# EAGLE design output_new (EAGLE 9.6.2)
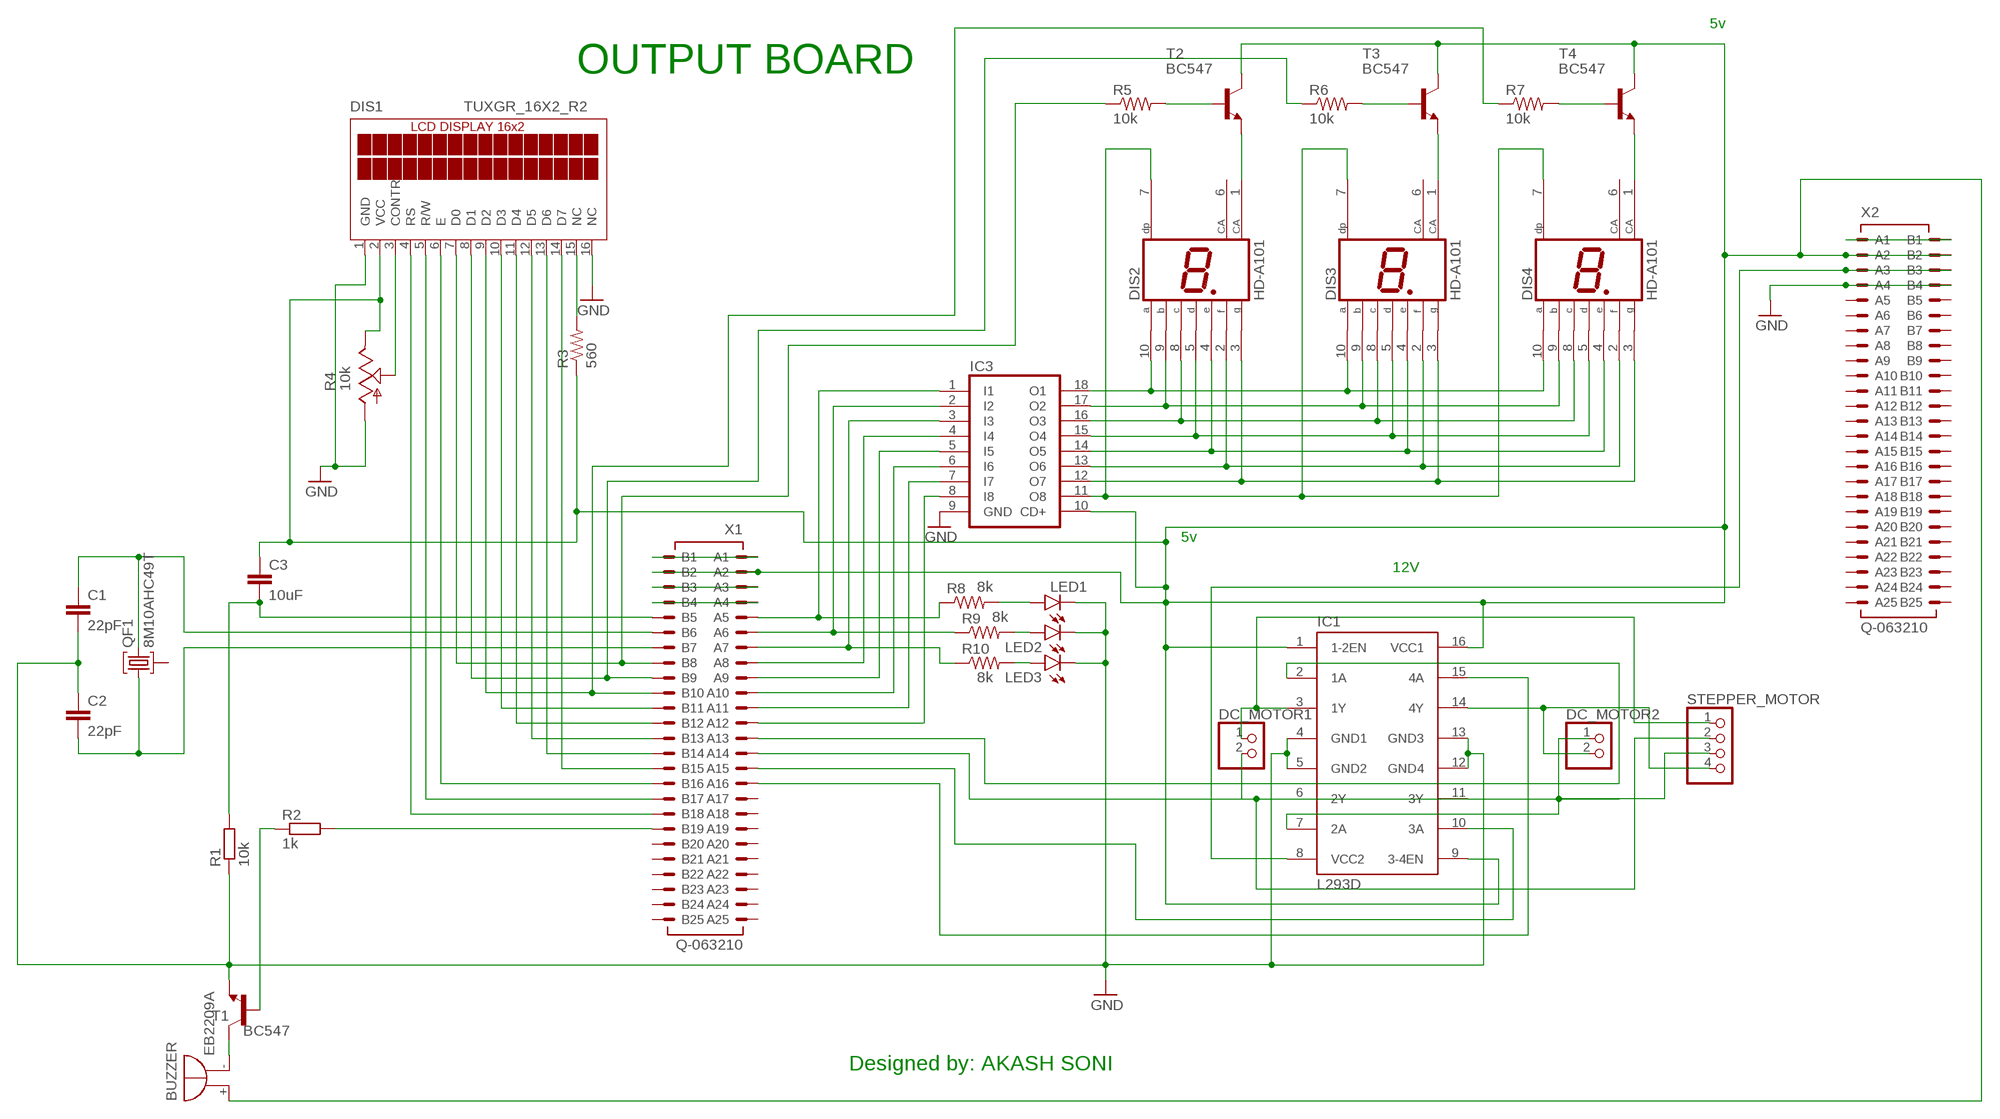
[diagram p0: schematic, sheet 1]

## Parts
BUZZER  EB2209A  [EB2209A]
C1  22pF  C2,5-3  [C2.5-3]
C2  22pF  C2,5-3  [C2.5-3]
C3  10uF  C2,5-3  [C2.5-3]
DC_MOTOR1  PINHD-1X2  [1X02]
DC_MOTOR2  PINHD-1X2  [1X02]
DIS1  TUXGR_16X2_R2  [TUXGR_16X2_R2]
DIS2  HD-A101  [HDSP-A]
DIS3  HD-A101  [HDSP-A]
DIS4  HD-A101  [HDSP-A]
IC1  L293D  [DIL16]
IC3  ULN2803A  [DIL18]
LED1  LED5MM  [LED5MM]
LED2  LED5MM  [LED5MM]
LED3  LED5MM  [LED5MM]
QF1  8M10AHC49T  [HC49U]
R1  10k  R-EU_0204/2V  [0204V]
R2  1k  R-EU_0204/2V  [0204V]
R3  560  R-US_0204/2V  [0204V]
R4  10k  TRIM_US-CA6V  [CA6V]
R5  10k  R-US_0204/2V  [0204V]
R6  10k  R-US_0204/2V  [0204V]
R7  10k  R-US_0204/2V  [0204V]
R8  8k  R-US_0204/2V  [0204V]
R9  8k  R-US_0204/2V  [0204V]
R10  8k  R-US_0204/2V  [0204V]
STEPPER_MOTOR  PINHD-1X4  [1X04]
T1  BC547  [TO92]
T2  BC547  [TO92]
T3  BC547  [TO92]
T4  BC547  [TO92]
X1  Q-063210  [063210]
X2  Q-063210  [063210]

## Nets
GND: C1.2 C2.1 DIS1.1(GND) DIS1.16(NC) IC1.4(GND1) IC1.5(GND2) IC1.12(GND4) IC1.13(GND3) IC3.9(GND) LED1.K(C) LED2.K(C) LED3.K(C) R1.1 R4.A T1.1(E) X2.A4 X2.B4
N$1: DC_MOTOR1.1 IC1.3(1Y) STEPPER_MOTOR.1
N$2: DC_MOTOR1.2 IC1.6(2Y) STEPPER_MOTOR.2
N$3: DC_MOTOR2.2 IC1.14(4Y) STEPPER_MOTOR.4
N$4: DC_MOTOR2.1 IC1.7(2A) IC1.11(3Y) STEPPER_MOTOR.3
N$5: C3.2 R1.2 X1.B5
N$6: C1.1 QF1.3 X1.B6
N$7: IC1.2(1A) X1.A13
N$8: X1.A14
N$9: IC1.10(3A) X1.A15
N$10: IC1.15(4A) X1.A16
N$11: R2.2 X1.B19
N$12: C2.2 QF1.1 X1.B7
N$13: R2.1 T1.2(B)
N$14: BUZZER.- T1.3(C)
N$15: DIS1.14(D7) X1.B15
N$16: DIS1.13(D6) X1.B14
N$17: X2.A1 X2.B1
N$18: DIS1.11(D4) X1.B12
N$19: DIS1.10(D3) X1.B11
N$20: DIS1.9(D2) R7.1 X1.B10
N$21: DIS1.8(D1) R6.1 X1.B9
N$22: DIS1.12(D5) X1.B13
N$23: DIS1.15(NC) R3.2
N$24: DIS1.6(E) X1.B16
N$25: DIS1.5(R/W) X1.B17
N$26: DIS1.4(RS) X1.B18
N$27: DIS1.3(CONTR) R4.S
N$28: IC3.8(I8) X1.A12
N$29: IC3.7(I7) X1.A11
N$30: IC3.6(I6) X1.A10
N$31: IC3.5(I5) X1.A9
N$32: IC3.4(I4) X1.A8
N$34: IC3.2(I2) R9.1 X1.A6
N$35: IC3.1(I1) R8.1 X1.A5
N$36: DIS2.10(A) DIS3.10(A) DIS4.10(A) IC3.18(O1)
N$37: DIS2.9(B) DIS3.9(B) DIS4.9(B) IC3.17(O2)
N$38: DIS2.8(C) DIS3.8(C) DIS4.8(C) IC3.16(O3)
N$39: DIS2.5(D) DIS3.5(D) DIS4.5(D) IC3.15(O4)
N$40: DIS2.4(E) DIS3.4(E) DIS4.4(E) IC3.14(O5)
N$41: DIS2.2(F) DIS3.2(F) DIS4.2(F) IC3.13(O6)
N$42: DIS2.3(G) DIS3.3(G) DIS4.3(G) IC3.12(O7)
N$43: DIS2.1(CA) T2.1(E)
N$44: DIS2.7(DP) DIS3.7(DP) DIS4.7(DP) IC3.11(O8)
N$45: DIS3.1(CA) T3.1(E)
N$46: DIS4.1(CA) T4.1(E)
N$47: R5.2 T2.2(B)
N$48: R6.2 T3.2(B)
N$49: R7.2 T4.2(B)
N$50: LED1.A R8.2
N$51: LED2.A R9.2
N$52: LED3.A R10.2
N$53: IC1.8(VCC2) X2.A3 X2.B3
N$54: DIS1.7(D0) R5.1 X1.B8
N$56: X1.A1 X1.B1
N$112: BUZZER.+ C3.1 DIS1.2(VCC) IC1.1(1-2EN) IC1.9(3-4EN) IC1.16(VCC1) IC3.10(CD+) R3.1 R4.E T2.3(C) T3.3(C) T4.3(C) X1.A2 X1.B2 X2.A2 X2.B2
N$113: X1.A3 X1.B3
N$114: X1.A4 X1.B4
N$115: IC3.3(I3) R10.1 X1.A7
Unconnected: DIS2.6(CA) DIS3.6(CA) DIS4.6(CA) QF1.2 X1.A17 X1.A18 X1.A19 X1.A20 X1.A21 X1.A22 X1.A23 X1.A24 X1.A25 X1.B20 X1.B21 X1.B22 X1.B23 X1.B24 X1.B25 X2.A5 X2.A6 X2.A7 X2.A8 X2.A9 X2.A10 X2.A11 X2.A12 X2.A13 X2.A14 X2.A15 X2.A16 X2.A17 X2.A18 X2.A19 X2.A20 X2.A21 X2.A22 X2.A23 X2.A24 X2.A25 X2.B5 X2.B6 X2.B7 X2.B8 X2.B9 X2.B10 X2.B11 X2.B12 X2.B13 X2.B14 X2.B15 X2.B16 X2.B17 X2.B18 X2.B19 X2.B20 X2.B21 X2.B22 X2.B23 X2.B24 X2.B25

## Notes on the sheet
- 5v
- OUTPUT BOARD
- 5v
- 12V
- Designed by: AKASH SONI

## Library data of the parts
BUZZER = buzzer:EB2209A: BUZZER Source: Buerklin; OC_FARNELL: unknown; OC_NEWARK: unknown
C1-C3 = capacitor-wima:C: CAPACITOR naming: grid - package width
DC_MOTOR1 DC_MOTOR2 = pinhead:PINHD-1X2: PIN HEADER
DIS1 = display-lcd:TUXGR_16X2_R2: Tuxgraphics LCD display 16x2 characters reflective, without background light Source: tuxgr_12x2_r2.pdf; OC_FARNELL: unknown; OC_NEWARK: unknown
DIS2-DIS4 = display-hp:HD-A101: LED DISPLAY 1-character 7 segment, decimal point right; OC_FARNELL: unknown; OC_NEWARK: unknown
IC1 = st-microelectronics:L293D: PUSH-PULL 4 CHANNEL DRIVER; MPN: L293D; OC_FARNELL: 9589619; OC_NEWARK: 56P8249
IC3 = uln-udn:ULN2803A: DRIVER ARRAY
LED1-LED3 = led:LED: LED OSRAM: - CHIPLED LG R971, LG N971, LY N971, LG Q971, LY Q971, LO R971, LY R971 LH N974, LH R974 LS Q976, LO Q976, LY Q976 LO Q996 - Hyper CHIPLED LW Q18S LB Q993, LB Q99A, LB R99A - SideLED LS A670, LO A670, LY A670, LG A670, LP A670 LB A673, LV A673, LT A673, LW A673 LH A674 LY A675 LS A676, LA A676, LO A676, LY A676, LW A676 LS A679, LY A679, LG A679 - Hyper Micro SIDELED® LS Y876, LA Y876, LO Y876, LY Y876 LT Y87S - SmartLED LW L88C, LW L88S LB L89C, LB L89S, LG L890 LS L89K, LO L89K, LY L89K LS L896, LA L896, LO L896, LY L896 - TOPLED LS T670, LO T670, LY T670, LG T670, LP T670 LSG T670, LSP T670, LSY T670, LOP T670, LYG T670 LG T671, LOG T671, LSG T671 LB T673, LV T673, LT T673, LW T673 LH T674 LS T676, LA T676, LO T676, LY T676, LB T676, LH T676, LSB T676, LW T676 LB T67C, LV T67C, LT T67C, LS T67K, LO T67K, LY T67K, LW E67C LS E67B, LA E67B, LO E67B, LY E67B, LB E67C, LV E67C, LT E67C LW T67C LS T679, LY T679, LG T679 LS T770, LO T770, LY T770, LG T770, LP T770 LB T773, LV T773, LT T773, LW T773 LH T774 LS E675, LA E675, LY E675, LS T675 LS T776, LA T776, LO T776, LY T776, LB T776 LHGB T686 LT T68C, LB T68C - Hyper Mini TOPLED® LB M676 - Mini TOPLED Santana® LG M470 LS M47K, LO M47K, LY M47K Source: http://www.osram.convergy.de LUXEON: - LUMILED® LXK2-PW12-R00, LXK2-PW12-S00, LXK2-PW14-U00, LXK2-PW14-V00 LXK2-PM12-R00, LXK2-PM12-S00, LXK2-PM14-U00 LXK2-PE12-Q00, LXK2-PE12-R00, LXK2-PE12-S00, LXK2-PE14-T00, LXK2-PE14-U00 LXK2-PB12-K00, LXK2-PB12-L00, LXK2-PB12-M00, LXK2-PB14-N00, LXK2-PB14-P00, LXK2-PB14-Q00 LXK2-PR12-L00, LXK2-PR12-M00, LXK2-PR14-Q00, LXK2-PR14-R00 LXK2-PD12-Q00, LXK2-PD12-R00, LXK2-PD12-S00 LXK2-PH12-R00, LXK2-PH12-S00 LXK2-PL12-P00, LXK2-PL12-Q00, LXK2-PL12-R00 Source: www.luxeon.com KINGBRIGHT: KA-3528ASYC Source: www.kingbright.com
QF1 = crystal:8M10AHC49T: Monolithic Crystal Filters Source: www.vanlong.com; OC_FARNELL: unknown; OC_NEWARK: unknown
R1 R2 = rcl:R-EU_: RESISTOR, European symbol; SPICEPREFIX: R
R3 R5-R10 = rcl:R-US_: RESISTOR, American symbol; SPICEPREFIX: R
R4 = pot:TRIM_US-: POTENTIOMETER
STEPPER_MOTOR = pinhead:PINHD-1X4: PIN HEADER
T1-T4 = transistor:BC547: NPN TRANSISTOR
X1 X2 = con-erni:Q-063210: Male Connector SMC-Q 50 contacts Standard Assembly Height Source: http://www.erni.com/DB/PDF-Drawing/SMC/063210.pdf; OC_FARNELL: unknown; OC_NEWARK: unknown

## Board
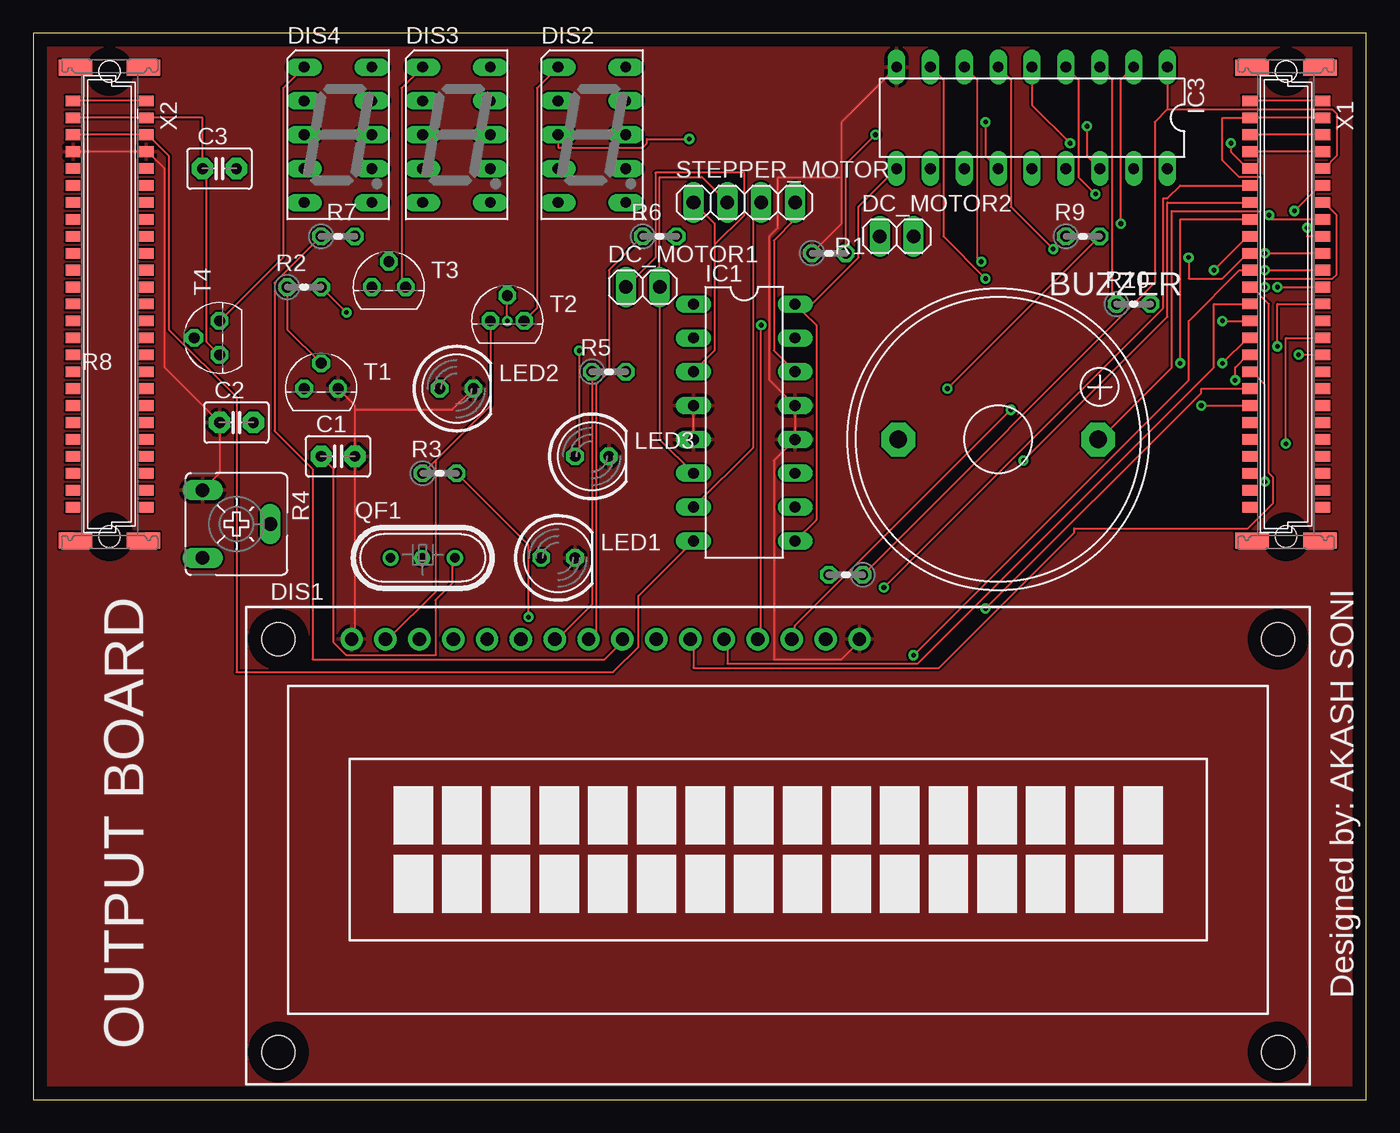
[diagram p1: board, top side]
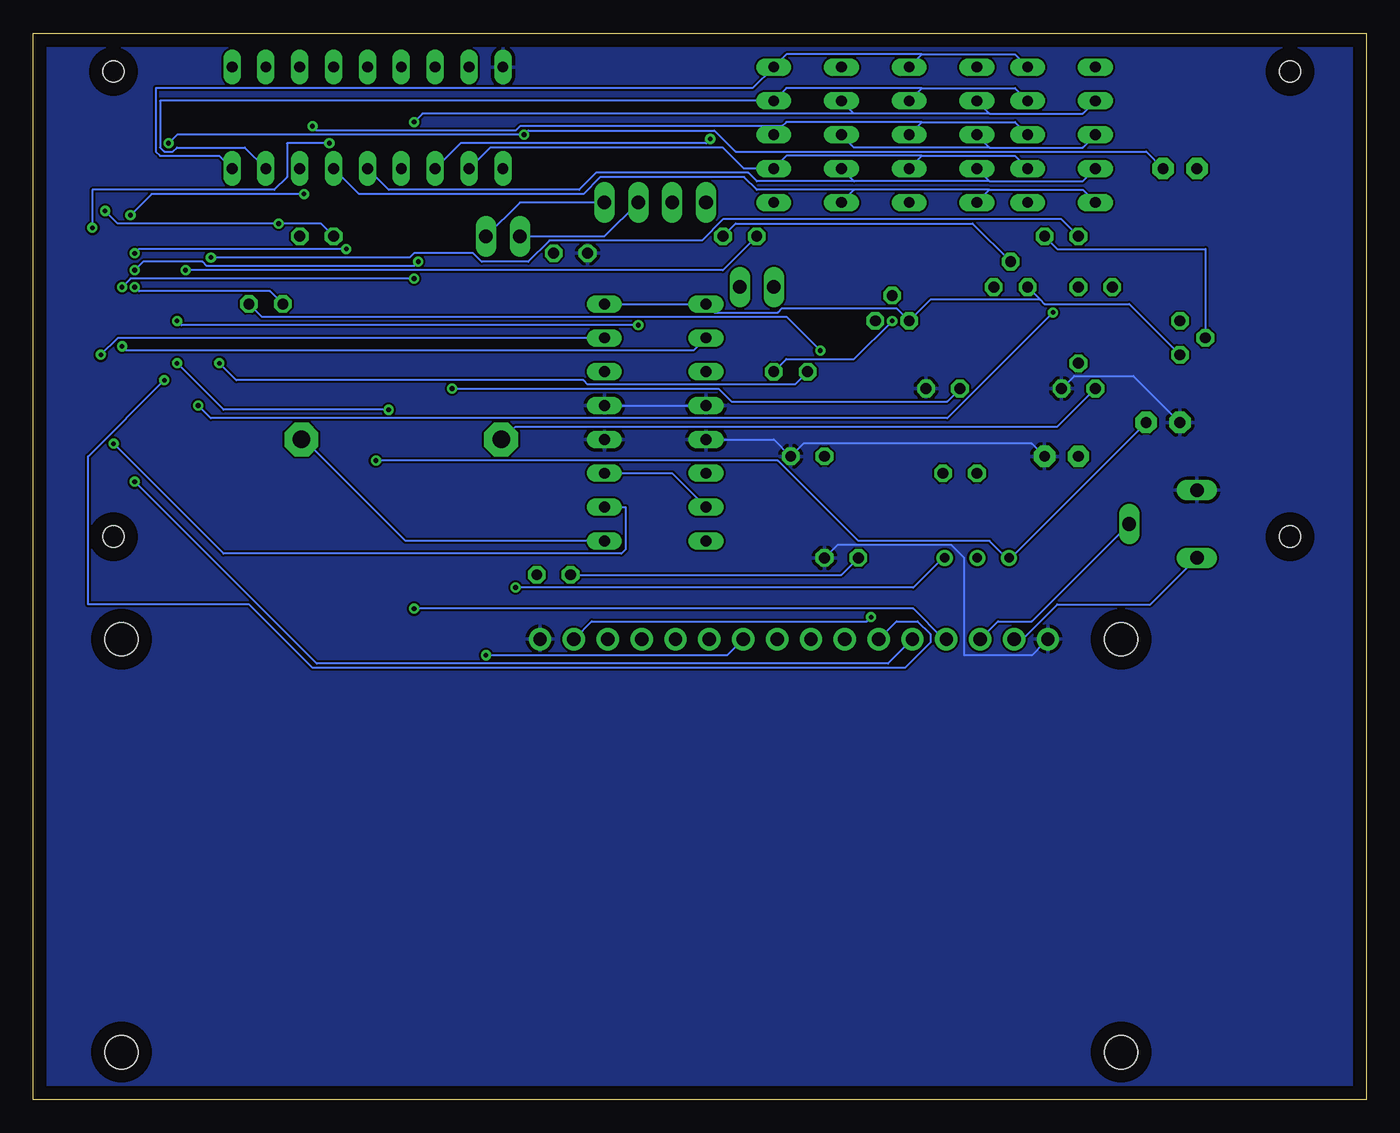
[diagram p2: board, bottom side, seen from below]

Size 100 x 80 mm. Coordinates in mm from the lower left corner, seen from the top.
Outline: 0,0 100,0 100,80 0,80 0,0
Copper layers (1*16): Top 0.035mm / dielectric 1.5mm / Bottom 0.035mm
Design rules "default": minimum track width 6mil, minimum drill 0.35mm, track to track 6mil, track to pad 6mil, pad to pad 6mil, via to via 6mil, smd to smd 6mil, copper to edge 40mil, drill to drill 6mil, minimum pad ring 10mil, minimum via ring 8mil, stop-mask expansion 4mil, vias tented up to drill 0mil, thermal gap 10mil

### Footprints (pad centres in the part's own frame; a part is rotated, then mirrored left to right if it is on the bottom)
EB2209A = drill 1.321 pad 2.54 octagon: + 7.493,0; - -7.493,0
C2.5-3 = drill 0.813 pad 1.6 octagon: 1 -1.27,0; 2 1.27,0
1X02 = drill 1.016 long: 1 -1.27,0; 2 1.27,0
TUXGR_16X2_R2 = drill 1 pad 1.676: 1 -32,15.5; 2 -29.46,15.5; 3 -26.92,15.5; 4 -24.38,15.5; 5 -21.84,15.5; 6 -19.3,15.5; 7 -16.76,15.5; 8 -14.22,15.5; 9 -11.68,15.5; 10 -9.14,15.5; 11 -6.6,15.5; 12 -4.06,15.5; 13 -1.52,15.5; 14 1.02,15.5; 15 3.56,15.5; 16 6.1,15.5 | hole 2.5: -37.5,-15.5; 37.5,-15.5; -37.5,15.5; 37.5,15.5
HDSP-A = drill 0.813 long: 1 -2.54,5.08; 2 -2.54,2.54; 3 -2.54,0; 4 -2.54,-2.54; 5 -2.54,-5.08; 6 2.54,-5.08; 7 2.54,-2.54; 8 2.54,0; 9 2.54,2.54; 10 2.54,5.08
DIL16 = drill 0.813 long: 1 -8.89,-3.81; 2 -6.35,-3.81; 3 -3.81,-3.81; 4 -1.27,-3.81; 5 1.27,-3.81; 6 3.81,-3.81; 7 6.35,-3.81; 8 8.89,-3.81; 9 8.89,3.81; 10 6.35,3.81; 11 3.81,3.81; 12 1.27,3.81; 13 -1.27,3.81; 14 -3.81,3.81; 15 -6.35,3.81; 16 -8.89,3.81
DIL18 = drill 0.813 long: 1 -10.16,-3.81; 2 -7.62,-3.81; 3 -5.08,-3.81; 4 -2.54,-3.81; 5 0,-3.81; 6 2.54,-3.81; 7 5.08,-3.81; 8 7.62,-3.81; 9 10.16,-3.81; 10 10.16,3.81; 11 7.62,3.81; 12 5.08,3.81; 13 2.54,3.81; 14 0,3.81; 15 -2.54,3.81; 16 -5.08,3.81; 17 -7.62,3.81; 18 -10.16,3.81
LED5MM = drill 0.813 octagon: A -1.27,0; K 1.27,0
HC49U = drill 0.7 pad 1.2: 1 -2.413,0; 2 -0.027,0; 3 2.413,0
0204V = drill 0.813 octagon: 1 -1.27,0; 2 1.27,0
CA6V = drill 1.016 long: A -2.54,-2.54; E 2.54,-2.54; S 0,2.54
1X04 = drill 1.016 long: 1 -3.81,0; 2 -1.27,0; 3 1.27,0; 4 3.81,0
TO92 = drill 0.813 octagon: 1 1.27,0; 2 0,1.905; 3 -1.27,0
063210 = smd 0.8 x 1.1: A1 -15.24,2.765; A2 -13.97,2.765; A3 -12.7,2.765; A4 -11.43,2.765; A5 -10.16,2.765; A6 -8.89,2.765; A7 -7.62,2.765; A8 -6.35,2.765; A9 -5.08,2.765; A10 -3.81,2.765; A11 -2.54,2.765; A12 -1.27,2.765; A13 0,2.765; A14 1.27,2.765; A15 2.54,2.765; A16 3.81,2.765; A17 5.08,2.765; A18 6.35,2.765; A19 7.62,2.765; A20 8.89,2.765; A21 10.16,2.765; A22 11.43,2.765; A23 12.7,2.765; A24 13.97,2.765; A25 15.24,2.765; B1 -15.24,-2.74; B2 -13.97,-2.74; B3 -12.7,-2.74; B4 -11.43,-2.74; B5 -10.16,-2.74; B6 -8.89,-2.74; B7 -7.62,-2.74; B8 -6.35,-2.74; B9 -5.08,-2.74; B10 -3.81,-2.74; B11 -2.54,-2.74; B12 -1.27,-2.74; B13 0,-2.74; B14 1.27,-2.74; B15 2.54,-2.74; B16 3.81,-2.74; B17 5.08,-2.74; B18 6.35,-2.74; B19 7.62,-2.74; B20 8.89,-2.74; B21 10.16,-2.74; B22 11.43,-2.74; B23 12.7,-2.74; B24 13.97,-2.74; B25 15.24,-2.74 | smd 1.2 x 2.5: M1 -17.745,2.55; M2 -17.745,-2.55; M3 17.745,-2.55; M4 17.745,2.55 | hole 1.6: -17.45,0; 17.45,0

### Placement (x,y rotation side)
BUZZER  72.39,49.53 0 top
C1  22.86,48.26 0 top
C2  15.24,50.8 0 top
C3  13.97,69.85 0 top
DC_MOTOR1  45.72,60.96 0 top
DC_MOTOR2  64.77,64.77 0 top
DIS1  55.88,19.05 0 top
DIS2  41.91,72.39 0 top
DIS3  31.75,72.39 0 top
DIS4  22.86,72.39 0 top
IC1  53.34,50.8 270 top
IC3  74.93,73.66 180 top
LED1  39.37,40.64 0 top
LED2  31.75,53.34 0 top
LED3  41.91,48.26 0 top
QF1  29.21,40.64 0 top
R1  59.69,63.5 0 top
R2  20.32,60.96 0 top
R3  30.48,46.99 0 top
R4  15.24,43.18 270 top
R5  43.18,54.61 0 top
R6  46.99,64.77 0 top
R7  22.86,64.77 0 top
R8  60.96,39.37 180 top
R9  78.74,64.77 0 top
R10  82.55,59.69 0 top
STEPPER_MOTOR  53.34,67.31 0 top
T1  21.59,53.34 0 top
T2  35.56,58.42 0 top
T3  26.67,60.96 0 top
T4  13.97,57.15 90 top
X1  93.98,59.69 270 top
X2  5.71,59.69 270 top

### Tracks (layer width: path | path; a pad name or v marks a point on that pad's centre or on a via)
GND
  Top 0.152: R1.1 60.64,65.72 60.64,69.22 | 60.64,69.22 60.64,73.34 IC3.9 | IC1.5 IC1.4 | DIS1.16 61.91,34.29 60.64,33.02 55.56,33.02 55.56,47.94 IC1.12 IC1.13 55.24,53.98 55.24,64.77 55.88,65.41 55.88,69.22 60.64,69.22 | X2.B4 X2.A4 8.57,71.12 9.84,69.85 9.84,54.93 C2.1 13.97,46.99 R4.A | T1.1 24.13,52.07 24.13,51.75 | 24.13,51.75 C1.2 24.13,34.61 DIS1.1 | LED2.K 31.43,51.75 24.13,51.75
  Bottom 0.152: IC1.5 44.45,49.53 LED3.K 42.23,49.21 25.08,49.21 C1.2 | IC1.13 IC1.4 | LED1.K 39.69,41.59 31.11,41.59 30.16,40.64 30.16,33.34 25.08,33.34 24.13,34.29 DIS1.1 | C2.1 17.46,54.29 21.91,54.29 T1.1
  pour Top: -0.64,80.64 -0.64,-0.64 100.97,-0.64 100.97,80.64
  pour Bottom: -1.27,81.28 -1.27,-1.27 101.6,-1.27 101.6,81.28
N$1
  Top 0.152: IC1.3 51.12,56.2 51.12,64.14 | 51.12,64.14 51.12,65.72 STEPPER_MOTOR.1 | DC_MOTOR1.1 46.67,63.18 46.67,69.53 53.34,69.53 53.34,66.36 51.12,64.14
N$2
  Top 0.152: IC1.6 46.99,49.53 DC_MOTOR1.2 46.99,69.22 50.16,69.22 STEPPER_MOTOR.2
N$3
  Top 0.152: IC1.14 55.56,56.2 55.56,64.45 57.15,66.04 STEPPER_MOTOR.4
  Bottom 0.152: DC_MOTOR2.2 63.5,67.31 STEPPER_MOTOR.4
N$4
  Top 0.152: IC1.7 53.98,48.9 53.98,66.67 STEPPER_MOTOR.3
  Bottom 0.152: IC1.7 52.07,46.99 IC1.11 | STEPPER_MOTOR.3 57.15,64.77 DC_MOTOR2.1
N$5  (via drill 0.35)
  Top 0.152: v89.85,71.75 89.85,71.12 91.12,69.85 X1.B5 | v63.18,72.39 60.96,70.17 R1.2
  Bottom 0.152: v89.85,71.75 89.22,72.39 v63.18,72.39 62.87,72.71 48.9,72.71 47.31,71.12 16.51,71.12 C3.2
N$6  (via drill 0.35)
  Top 0.152: X1.B6 86.04,68.58 85.09,67.63 84.77,67.63 84.77,59.37 v63.82,38.42 | C1.1 22.54,47.31 22.54,34.29 23.5,33.34 30.16,33.34 30.16,37.47 31.43,38.73 31.43,40.64 QF1.3
  Bottom 0.152: v63.82,38.42 33.97,38.42 31.75,40.64 QF1.3
N$7  (via drill 0.35)
  Top 0.152: X1.A13 93.34,59.69 v93.34,56.52
  Bottom 0.152: v93.34,56.52 93.03,56.2 50.48,56.2 IC1.2
N$9  (via drill 0.35)
  Top 0.152: X1.A15 93.98,57.15 v93.98,49.21
  Bottom 0.152: v93.98,49.21 85.72,40.96 55.88,40.96 55.56,41.27 55.56,44.45 IC1.10
N$10  (via drill 0.35)
  Top 0.152: v94.93,55.88 X1.A16
  Bottom 0.152: v94.93,55.88 93.66,57.15 IC1.15
N$11  (via drill 0.35)
  Top 0.152: v87.63,52.07 X1.B19 | R2.2 v23.5,59.05
  Bottom 0.152: v87.63,52.07 86.68,51.12 31.43,51.12 v23.5,59.05
N$12  (via drill 0.35)
  Top 0.152: X1.B7 85.09,67.31 85.09,58.74 v74.3,47.94
  Bottom 0.152: v74.3,47.94 44.13,47.94 38.1,41.91 28.26,41.91 26.99,40.64 QF1.1 26.67,40.64 C2.2
N$13
  Top 0.152: T1.2 19.05,57.78 R2.1
N$14
  Bottom 0.152: T1.3 23.18,50.48 63.82,50.48 64.77,49.53 BUZZER.-
N$15  (via drill 0.35)
  Top 0.152: v89.22,55.24 91.12,57.15 X1.B15 | v73.34,51.75 57.15,35.56 57.15,34.61 DIS1.14
  Bottom 0.152: v89.22,55.24 85.72,51.75 v73.34,51.75
N$16  (via drill 0.35)
  Top 0.152: v89.22,58.42 X1.B14 | v54.61,58.1 54.61,34.61 DIS1.13
  Bottom 0.152: v89.22,58.42 88.9,58.1 v54.61,58.1
N$17
  Top 0.152: X2.A1 X2.B1
N$18
  Top 0.152: X1.B12 91.44,60.96 92.71,59.69 92.71,46.99 93.03,46.67 93.03,44.77 91.12,42.86 78.11,42.86 78.11,42.55 67.94,32.38 49.53,32.38 49.53,34.29 DIS1.11
N$19  (via drill 0.35)
  Top 0.152: X1.B11 90.49,62.23 86.68,58.42 86.68,53.98 v66.04,33.34
  Bottom 0.152: v66.04,33.34 47.94,33.34 46.99,34.29 DIS1.10
N$20  (via drill 0.35)
  Top 0.152: v86.68,63.18 86.68,61.59 89.22,61.59 91.12,63.5 X1.B10 | R7.1 18.1,61.28 18.1,50.16 20.95,47.31 20.95,33.02 42.86,33.02 44.13,34.29 DIS1.9
  Bottom 0.152: v86.68,63.18 71.75,63.18 71.44,63.5 66.99,63.5 66.36,62.87 62.87,62.87 61.28,64.45 49.85,64.45 48.26,66.04 22.86,66.04 R7.1
N$21  (via drill 0.35)
  Top 0.152: v88.58,62.23 91.12,64.77 X1.B9 | R6.1 43.18,62.23 43.18,54.61 42.23,53.66 42.23,34.92 41.91,34.61 DIS1.8
  Bottom 0.152: v88.58,62.23 48.26,62.23 R6.1
N$22
  Top 0.152: X1.B13 88.58,59.69 88.58,54.93 66.36,32.7 52.07,32.7 52.07,34.29 DIS1.12
N$23  (via drill 0.35)
  Top 0.152: R3.2 37.15,41.59 v37.15,36.2
  Bottom 0.152: v37.15,36.2 37.47,35.88 58.1,35.88 59.37,34.61 DIS1.15
N$24  (via drill 0.35)
  Top 0.152: v90.17,53.98 90.17,54.93 91.12,55.88 X1.B16
  Bottom 0.152: v90.17,53.98 95.89,48.26 95.89,37.15 83.82,37.15 79.06,32.38 34.61,32.38 32.7,34.29 32.7,34.92 33.66,35.88 35.24,35.88 36.51,34.61 DIS1.6
N$25  (via drill 0.35)
  Top 0.152: v92.39,46.35 92.39,53.66 91.44,54.61 X1.B17
  Bottom 0.152: v92.39,46.35 78.74,32.7 35.88,32.7 34.29,34.29 DIS1.5
N$26  (via drill 0.35)
  Top 0.152: X1.B18 87.63,53.34 87.63,53.02 v71.44,36.83
  Bottom 0.152: v71.44,36.83 33.97,36.83 31.75,34.61 DIS1.4
N$27
  Bottom 0.152: R4.S 25.08,35.88 27.62,35.88 28.89,34.61 DIS1.3
N$28  (via drill 0.35)
  Top 0.152: v93.34,60.96 X1.A12 | v71.44,61.59 68.26,64.77 68.26,76.52 IC3.8
  Bottom 0.152: v93.34,60.96 92.71,61.59 v71.44,61.59
N$29  (via drill 0.35)
  Top 0.152: v92.39,62.23 X1.A11 | v71.12,62.87 70.8,63.18 70.8,76.52 IC3.7
  Bottom 0.152: v92.39,62.23 91.76,62.87 87.31,62.87 87,62.55 71.44,62.55 v71.12,62.87
N$30  (via drill 0.35)
  Top 0.152: v92.39,63.5 X1.A10 | v76.52,63.82 73.34,66.99 73.34,76.52 IC3.6
  Bottom 0.152: v92.39,63.5 92.08,63.82 v76.52,63.82
N$31  (via drill 0.35)
  Top 0.152: X1.A9 95.57,64.77 v95.57,65.41 | v77.79,71.75 74.93,74.61 IC3.5
  Bottom 0.152: v95.57,65.41 95.57,68.26 81.92,68.26 80.96,69.22 80.96,71.75 v77.79,71.75
N$32  (via drill 0.35)
  Top 0.152: X1.A8 92.71,66.04 v92.71,66.36 | v79.69,67.94 78.42,69.22 78.42,76.52 IC3.4
  Bottom 0.152: v92.71,66.36 91.12,67.94 v79.69,67.94
N$34  (via drill 0.35)
  Top 0.152: v94.61,66.67 96.52,68.58 X1.A6 | IC3.2 81.6,76.52 v81.6,65.72
  Bottom 0.152: v94.61,66.67 93.66,65.72 v81.6,65.72 78.42,65.72 R9.1
N$35
  Top 0.152: 85.09,74.3 97.47,74.3 97.79,73.98 97.79,70.8 96.84,69.85 X1.A5 | IC3.1 85.09,74.3 | R8.1 84.14,61.28 84.14,73.34 85.09,74.3
N$36
  Bottom 0.152: DIS4.10 26.35,78.42 33.34,78.42 | DIS3.10 33.34,78.42 | 33.34,78.42 43.5,78.42 DIS2.10 46.04,75.88 90.81,75.88 90.81,71.12 90.49,70.8 86.04,70.8 IC3.18
N$37
  Bottom 0.152: DIS4.9 26.35,75.88 33.34,75.88 | DIS3.9 33.34,75.88 | 33.34,75.88 43.5,75.88 DIS2.9 90.49,74.93 90.49,71.44 90.17,71.12 89.53,71.12 89.22,71.44 84.14,71.44 IC3.17
N$38  (via drill 0.35)
  Top 0.152: IC3.16 79.06,70.8 v79.06,73.03
  Bottom 0.152: DIS4.8 26.35,73.34 33.34,73.34 | DIS3.8 33.34,73.34 | 43.81,73.03 43.5,73.34 33.34,73.34 | v79.06,73.03 78.74,72.71 63.82,72.71 63.5,73.03 43.81,73.03 | 43.81,73.03 DIS2.8
N$39
  Bottom 0.152: DIS4.5 21.27,68.26 28.26,68.26 | DIS3.5 28.26,68.26 | 38.42,68.26 DIS2.5 | 28.26,68.26 38.42,68.26 | IC3.15 75.56,67.94 58.74,67.94 57.47,69.22 46.67,69.22 45.72,68.26 38.42,68.26
N$40
  Bottom 0.152: DIS4.4 21.27,68.9 28.26,68.9 | DIS3.4 28.26,68.9 | 38.42,68.9 DIS2.4 | 28.26,68.9 38.42,68.9 | IC3.14 73.34,68.26 59.05,68.26 57.78,69.53 46.35,69.53 45.72,68.9 38.42,68.9
N$41  (via drill 0.35)
  Top 0.152: IC3.13 71.44,70.8 v71.44,73.34
  Bottom 0.152: DIS4.2 21.27,73.98 28.26,73.98 | DIS3.2 28.26,73.98 | 38.42,73.98 DIS2.2 | 28.26,73.98 38.42,73.98 | v71.44,73.34 70.8,73.98 38.42,73.98
N$42  (via drill 0.35)
  Top 0.152: v49.21,72.07 46.04,72.07 46.04,71.75 45.72,71.44 39.37,71.44 DIS2.3
  Bottom 0.152: DIS4.3 21.27,71.44 28.26,71.44 | DIS3.3 28.26,71.44 | DIS2.3 38.42,71.44 28.26,71.44 | IC3.12 67.94,71.75 49.53,71.75 v49.21,72.07
N$43
  Top 0.152: T2.1 37.78,59.37 37.78,75.88 DIS2.1
N$44
  Bottom 0.152: DIS4.7 26.35,70.8 33.34,70.8 | DIS3.7 33.34,70.8 | 33.34,70.8 43.5,70.8 DIS2.7 46.67,69.85 48.26,71.44 65.72,71.44 IC3.11
N$45
  Top 0.152: T3.1 27.62,61.28 27.62,75.88 DIS3.1
N$46
  Top 0.152: T4.1 18.73,63.18 18.73,75.88 DIS4.1
N$47  (via drill 0.35)
  Top 0.152: v35.56,58.42 T2.2
  Bottom 0.152: v35.56,58.42 38.42,55.56 43.5,55.56 R5.2
N$48
  Bottom 0.152: T3.2 29.53,65.72 47.31,65.72 R6.2
N$49
  Bottom 0.152: T4.2 12.06,63.82 23.18,63.82 R7.2
N$50
  Bottom 0.152: LED1.A 39.37,39.37 R8.2
N$51  (via drill 0.35)
  Top 0.152: R9.2 v68.58,53.34
  Bottom 0.152: LED2.A 31.43,52.39 47.62,52.39 48.58,53.34 v68.58,53.34
N$52  (via drill 0.35)
  Top 0.152: LED3.A 40.96,48.58 v40.96,56.2
  Bottom 0.152: v40.96,56.2 43.5,58.74 82.87,58.74 R10.2
N$53
  Top 0.152: X2.B3 X2.A3 8.57,72.39 10.16,70.8 10.16,57.78 15.24,52.7 15.24,32.07 43.5,32.07 45.4,33.97 45.4,37.78 IC1.8
N$54  (via drill 0.35)
  Top 0.152: X1.B8 86.04,66.04 v86.04,55.24 | R5.1 41.91,37.15 39.37,34.61 DIS1.7
  Bottom 0.152: v86.04,55.24 84.77,53.98 58.74,53.98 58.42,53.66 42.86,53.66 R5.1
N$56
  Top 0.152: X1.A1 X1.B1
N$112
  Top 0.152: 30.16,47.94 34.29,52.07 T2.3 | 30.16,47.94 R3.1 | X2.B2 X2.A2 12.7,73.66 C3.1 13.02,69.53 13.02,56.83 T4.3 | 30.16,47.94 30.16,38.1 26.67,34.61 DIS1.2 | X1.A2 X1.B2 89.22,73.66 89.22,70.48 90.49,69.22 92.08,69.22 92.08,66.67 85.41,66.67 85.41,54.93 80.01,49.53 BUZZER.+ | IC1.9 58.74,43.5 58.74,58.1 57.78,59.05 | IC3.10 61.91,66.99 61.91,63.18 57.78,59.05 | 57.78,59.05 IC1.16
  Bottom 0.152: R4.E 16.19,37.15 23.18,37.15 25.72,34.61 26.35,34.61 DIS1.2 | T4.3 17.78,59.69 24.13,59.69 24.45,60.01 | T3.3 24.45,60.01 | 24.45,60.01 32.7,60.01 T2.3 35.24,59.37 43.81,59.37 44.13,59.05 48.9,59.05 IC1.1 IC1.16 | IC1.9 72.07,41.91 79.69,49.53 BUZZER.+
N$113
  Top 0.152: X1.A3 X1.B3
N$114
  Top 0.152: X1.A4 X1.B4
N$115  (via drill 0.35)
  Top 0.152: v92.39,60.96 92.39,61.59 97.47,61.59 97.79,61.91 97.79,66.36 96.84,67.31 X1.A7 | IC3.3 80.96,76.52 80.96,60.01 R10.1
  Bottom 0.152: v92.39,60.96 92.08,60.64 82.23,60.64 R10.1

### Text on the board
tPlace: Designed by: AKASH SONI | OUTPUT BOARD